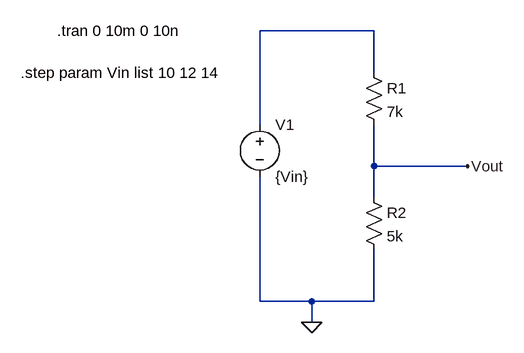
[diagram p0: schematic linear_regulator.asc]
linear_regulator.asc, the LTspice schematic file:
Version 4
SHEET 1 880 680
WIRE 304 -16 128 -16
WIRE 304 48 304 -16
WIRE 128 128 128 -16
WIRE 304 192 304 128
WIRE 448 192 304 192
WIRE 304 240 304 192
WIRE 128 400 128 208
WIRE 208 400 128 400
WIRE 304 400 304 320
WIRE 304 400 208 400
WIRE 208 432 208 400
FLAG 208 432 0
FLAG 448 192 Vout
SYMBOL voltage 128 112 R0
WINDOW 123 0 0 Left 0
WINDOW 39 0 0 Left 0
SYMATTR InstName V1
SYMATTR Value {Vin}
SYMBOL res 288 32 R0
SYMATTR InstName R1
SYMATTR Value 7k
SYMBOL res 288 224 R0
SYMATTR InstName R2
SYMATTR Value 5k
TEXT -184 -16 Left 2 !.tran 0 10m 0 10n
TEXT -240 48 Left 2 !.step param Vin list 10 12 14

The netlist it stands for:
* linear_regulator.asc
V1 N001 0 {Vin}
R1 N001 Vout 7k
R2 Vout 0 5k
.tran 0 10m 0 10n
.step param Vin list 10 12 14
.backanno
.end